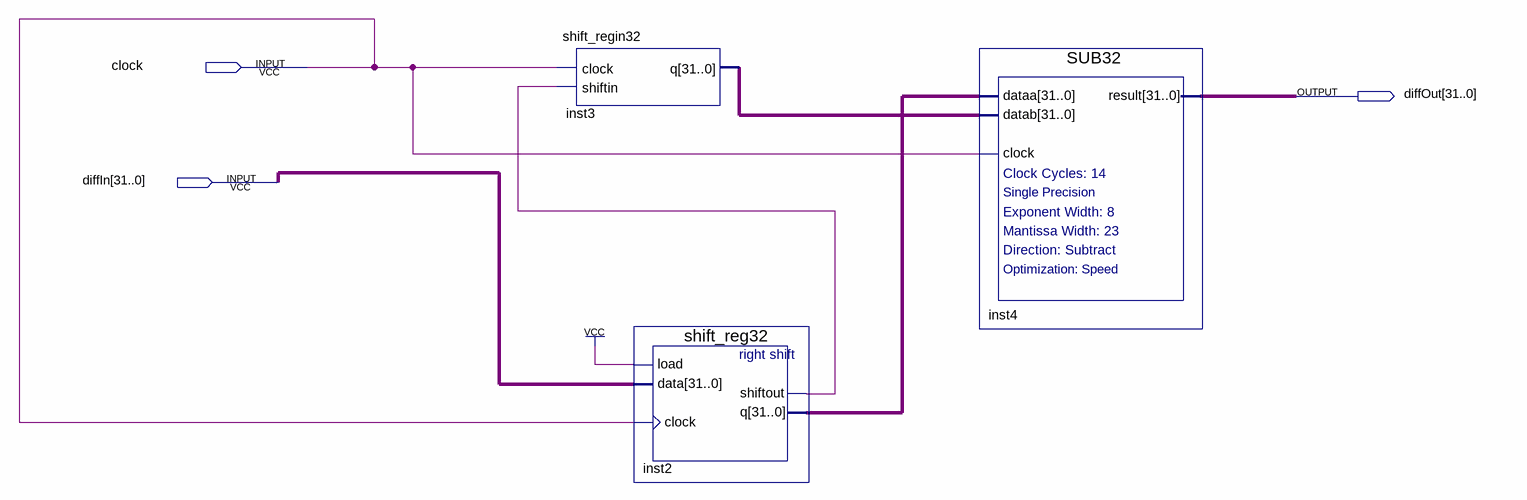
[diagram p0: schematic sheet]
// Quartus schematic diff.bdf as structural Verilog: 3 symbols, 3 pins
module diff (
  input  clock,
  input  [31:0] diffIn,
  output [31:0] diffOut
);

  wire inst2_shiftout;
  wire [31:0] inst2_q, inst3_q;

  shift_regin32 inst3 (.clock(clock), .shiftin(inst2_shiftout), .q(inst3_q));
  shift_reg32 inst2 (.load(1'b1), .data(diffIn), .clock(clock), .shiftout(inst2_shiftout), .q(inst2_q));
  SUB32 inst4 (.dataa(inst2_q), .datab(inst3_q), .clock(clock), .result(diffOut));
endmodule
